# Altium schematic sheet 5V_LS.SchDoc
size A4
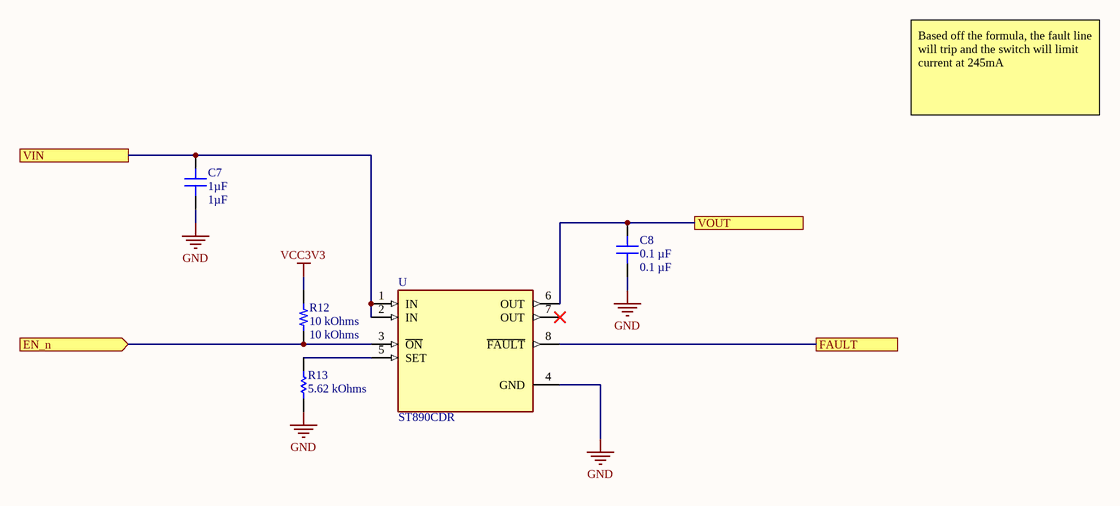
[diagram p0: 5V_LS.SchDoc]

## Parts
C7  1µF  [CAP 0805_2012]
C8  0.1 µF  [CAP 0805_2012]
R12  10 kOhms  [RES 0805_2012]
R13  5.62 kOhms  [RESC2013X60X40ML20T25]
U  ST890CDR  [SOIC127P600X175-8N]

## Ports
EN_n (in), FAULT, VIN, VOUT

## Nets
GND: C7.1 C8.1 R13.1 U.4(GND)
VCC3V3: R12.2
EN_n: R12.1 U.3(~{ON}) ; port EN_n
FAULT: U.8(~{FAULT}) ; port FAULT
VIN: C7.2 U.1(IN) U.2(IN) ; port VIN
VOUT: C8.2 U.6(OUT) ; port VOUT
NetR13_2: R13.2 U.5(SET)

Not connected (* = marked no-connect by the designer): U 7(OUT)*

## Notes on the sheet
- Based off the formula, the fault line will trip and the switch will limit current at 245mA

## Library data of the parts
C7 = MM05ZC105KCZ2A: CAP CER 1UF 10V X7R 0805; Part Number: MM05ZC105KCZ2A; Value: 1µF
C8 = CC0805MRX7R9BB104: CAP CER 0.1UF 50V X7R 0805; Part Number: CC0805MRX7R9BB104; Value: 0.1 µF
R12 = RNCS0805BKE10K0: RES 10K OHM 0.1% 1/10W 0805; Part Number: RNCS0805BKE10K0; Value: 10 kOhms
R13 = CMP-2001-00852-1: Part Number: ERA6AEB5621V; Manufacturer: Panasonic
U = ST890CDR: Power Switch/Driver 1:1 P-Channel 1.2A 8-SO; MF: STMicroelectronics; SnapEDA_Link: https://www.snapeda.com/parts/ST890CDR/STMicroelectronics/view-part/496092/?ref=snap; Availability: Unavailable; Price: None; MP: ST890CDR; Package: SOIC-8 STMicroelectronics; Value: *